# EAGLE design controller (EAGLE 4.11)
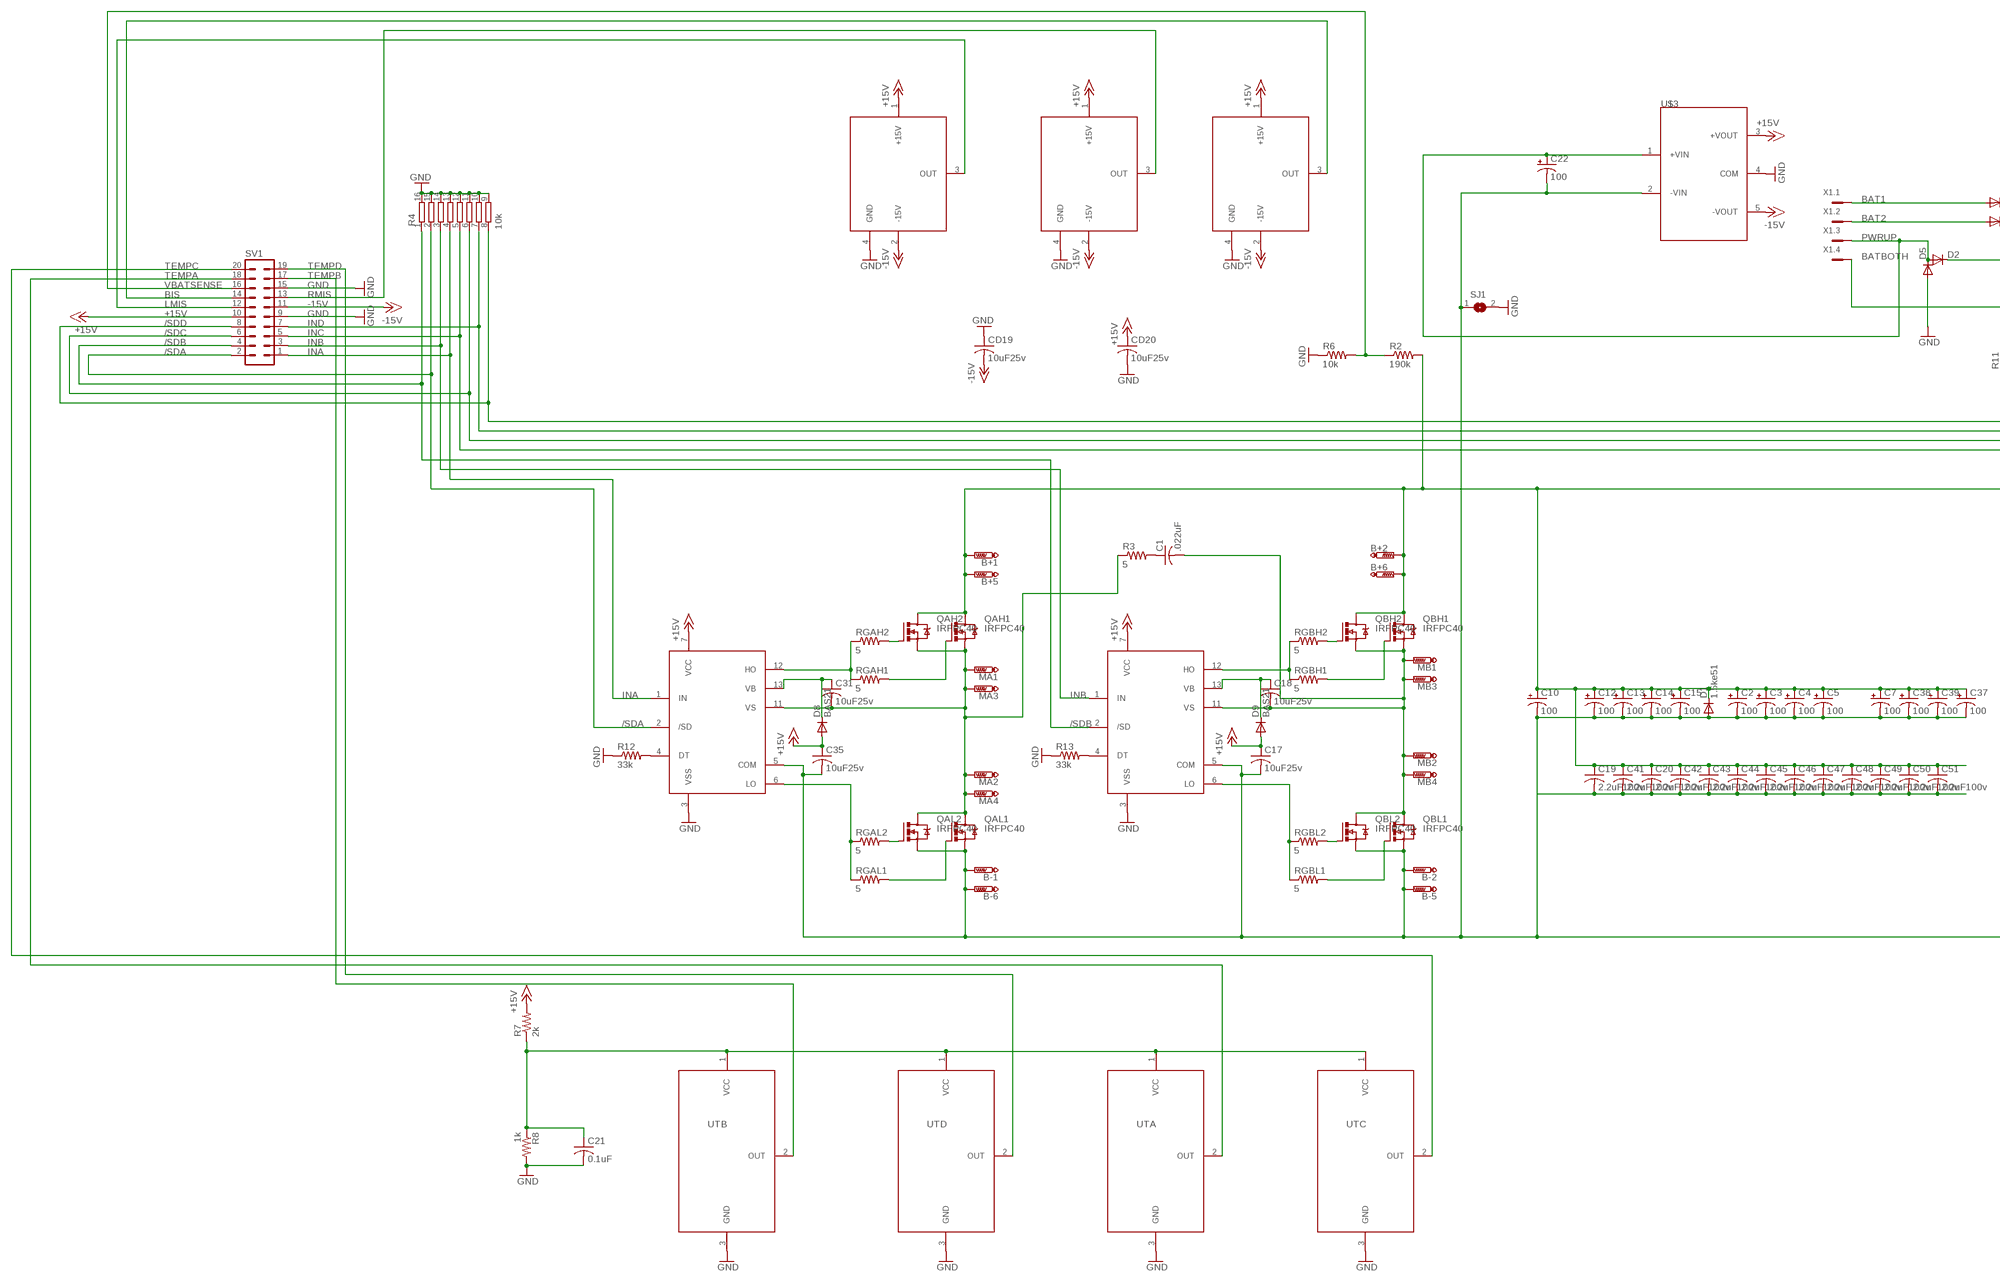
[diagram p0: schematic, sheet 1, part 1 of 2]
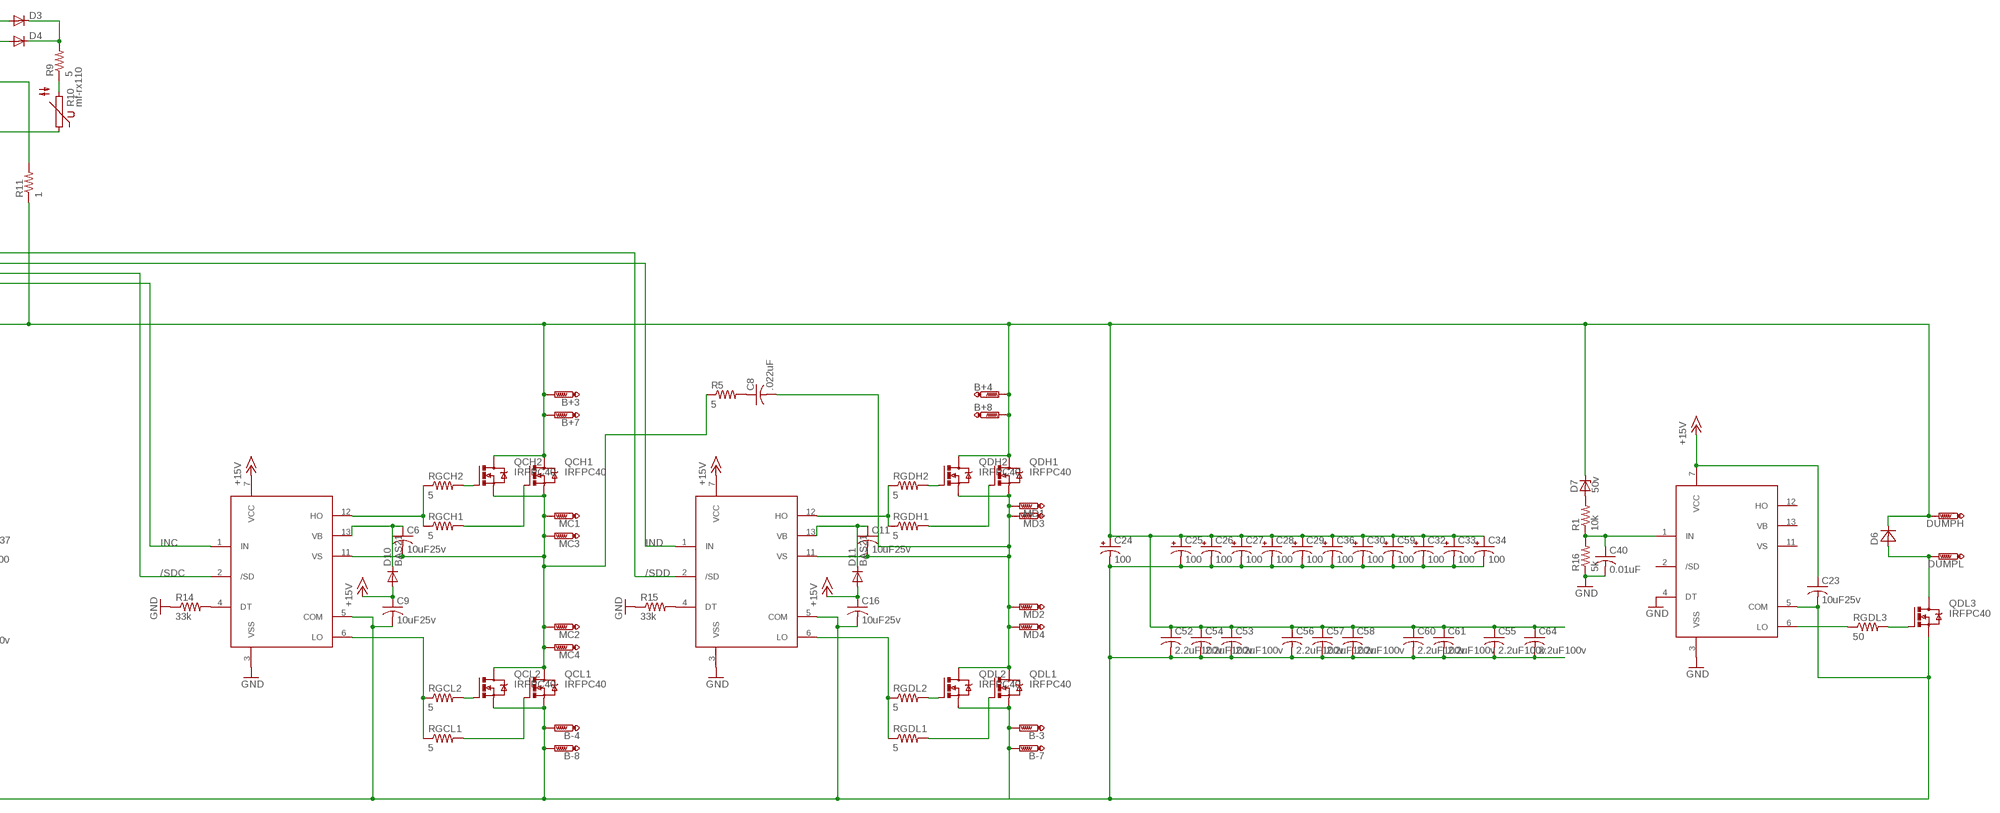
[diagram p1: schematic, sheet 1, part 2 of 2]

## Parts
B+1  PTR1PAD1-17Y  [P1-17Y]
B+2  PTR1PAD1-17Y  [P1-17Y]
B+3  PTR1PAD1-17Y  [P1-17Y]
B+4  PTR1PAD1-17Y  [P1-17Y]
B+5  PTR1PAD1-17Y  [P1-17Y]
B+6  PTR1PAD1-17Y  [P1-17Y]
B+7  PTR1PAD1-17Y  [P1-17Y]
B+8  PTR1PAD1-17Y  [P1-17Y]
B-1  PTR1PAD1-17Y  [P1-17Y]
B-2  PTR1PAD1-17Y  [P1-17Y]
B-3  PTR1PAD1-17Y  [P1-17Y]
B-4  PTR1PAD1-17Y  [P1-17Y]
B-5  PTR1PAD1-17Y  [P1-17Y]
B-6  PTR1PAD1-17Y  [P1-17Y]
B-7  PTR1PAD1-17Y  [P1-17Y]
B-8  PTR1PAD1-17Y  [P1-17Y]
C1  .022uF  C-US102-043X133  [C102-043X133]
C2  100  CPOL-USE5-10.5  [E5-10,5]
C3  100  CPOL-USE5-10.5  [E5-10,5]
C4  100  CPOL-USE5-10.5  [E5-10,5]
C5  100  CPOL-USE5-10.5  [E5-10,5]
C6  10uF25v  C-USC1206  [C1206]
C7  100  CPOL-USE5-10.5  [E5-10,5]
C8  .022uF  C-US102-043X133  [C102-043X133]
C9  10uF25v  C-USC1206  [C1206]
C10  100  CPOL-USE5-10.5  [E5-10,5]
C11  10uF25v  C-USC1206  [C1206]
C12  100  CPOL-USE5-10.5  [E5-10,5]
C13  100  CPOL-USE5-10.5  [E5-10,5]
C14  100  CPOL-USE5-10.5  [E5-10,5]
C15  100  CPOL-USE5-10.5  [E5-10,5]
C16  10uF25v  C-USC1206  [C1206]
C17  10uF25v  C-USC1206  [C1206]
C18  10uF25v  C-USC1206  [C1206]
C19  2.2uF100v  C-USC1812  [C1812]
C20  2.2uF100v  C-USC1812  [C1812]
C21  0.1uF  C-USC0805  [C0805]
C22  100  CPOL-USE5-10.5  [E5-10,5]
C23  10uF25v  C-USC1206  [C1206]
C24  100  CPOL-USE5-10.5  [E5-10,5]
C25  100  CPOL-USE5-10.5  [E5-10,5]
C26  100  CPOL-USE5-10.5  [E5-10,5]
C27  100  CPOL-USE5-10.5  [E5-10,5]
C28  100  CPOL-USE5-10.5  [E5-10,5]
C29  100  CPOL-USE5-10.5  [E5-10,5]
C30  100  CPOL-USE5-10.5  [E5-10,5]
C31  10uF25v  C-USC1206  [C1206]
C32  100  CPOL-USE5-10.5  [E5-10,5]
C33  100  CPOL-USE5-10.5  [E5-10,5]
C34  100  CPOL-USE5-10.5  [E5-10,5]
C35  10uF25v  C-USC1206  [C1206]
C36  100  CPOL-USE5-10.5  [E5-10,5]
C37  100  CPOL-USE5-10.5  [E5-10,5]
C38  100  CPOL-USE5-10.5  [E5-10,5]
C39  100  CPOL-USE5-10.5  [E5-10,5]
C40  0.01uF  C-USC0805  [C0805]
C41  2.2uF100v  C-USC1812  [C1812]
C42  2.2uF100v  C-USC1812  [C1812]
C43  2.2uF100v  C-USC1812  [C1812]
C44  2.2uF100v  C-USC1812  [C1812]
C45  2.2uF100v  C-USC1812  [C1812]
C46  2.2uF100v  C-USC1812  [C1812]
C47  2.2uF100v  C-USC1812  [C1812]
C48  2.2uF100v  C-USC1812  [C1812]
C49  2.2uF100v  C-USC1812  [C1812]
C50  2.2uF100v  C-USC1812  [C1812]
C51  2.2uF100v  C-USC1812  [C1812]
C52  2.2uF100v  C-USC1812  [C1812]
C53  2.2uF100v  C-USC1812  [C1812]
C54  2.2uF100v  C-USC1812  [C1812]
C55  2.2uF100v  C-USC1812  [C1812]
C56  2.2uF100v  C-USC1812  [C1812]
C57  2.2uF100v  C-USC1812  [C1812]
C58  2.2uF100v  C-USC1812  [C1812]
C59  100  CPOL-USE5-10.5  [E5-10,5]
C60  2.2uF100v  C-USC1812  [C1812]
C61  2.2uF100v  C-USC1812  [C1812]
C64  2.2uF100v  C-USC1812  [C1812]
CD19  10uF25v  C-USC1206  [C1206]
CD20  10uF25v  C-USC1206  [C1206]
D1  1.5ke51  DIODE-DO201-15  [DO201-15]
D2  DIODE-DO41-10  [DO41-10]
D3  DIODE-DO41-10  [DO41-10]
D4  DIODE-DO41-10  [DO41-10]
D5  DIODE-DO41-10  [DO41-10]
D6  DIODE-10  [D-10]
D7  50v  ZENER-DIODEZD-10  [ZDIO-10]
D8  BAS21  [SOT23]
D9  BAS21  [SOT23]
D10  BAS21  [SOT23]
D11  BAS21  [SOT23]
DRV1  IR21844S  [14-SOIC]
DRV2  IR21844S  [14-SOIC]
DRV3  IR21844S  [14-SOIC]
DRV4  IR21844S  [14-SOIC]
DUMPH  PTR1PAD1-17Y  [P1-17Y]
DUMPL  PTR1PAD1-17Y  [P1-17Y]
MA1  PTR1PAD1-17Y  [P1-17Y]
MA2  PTR1PAD1-17Y  [P1-17Y]
MA3  PTR1PAD1-17Y  [P1-17Y]
MA4  PTR1PAD1-17Y  [P1-17Y]
MB1  PTR1PAD1-17Y  [P1-17Y]
MB2  PTR1PAD1-17Y  [P1-17Y]
MB3  PTR1PAD1-17Y  [P1-17Y]
MB4  PTR1PAD1-17Y  [P1-17Y]
MC1  PTR1PAD1-17Y  [P1-17Y]
MC2  PTR1PAD1-17Y  [P1-17Y]
MC3  PTR1PAD1-17Y  [P1-17Y]
MC4  PTR1PAD1-17Y  [P1-17Y]
MD1  PTR1PAD1-17Y  [P1-17Y]
MD2  PTR1PAD1-17Y  [P1-17Y]
MD3  PTR1PAD1-17Y  [P1-17Y]
MD4  PTR1PAD1-17Y  [P1-17Y]
QAH1  IRFPC40  [TO247BV]
QAH2  IRFPC40  [TO247BV]
QAL1  IRFPC40  [TO247BV]
QAL2  IRFPC40  [TO247BV]
QBH1  IRFPC40  [TO247BV]
QBH2  IRFPC40  [TO247BV]
QBL1  IRFPC40  [TO247BV]
QBL2  IRFPC40  [TO247BV]
QCH1  IRFPC40  [TO247BV]
QCH2  IRFPC40  [TO247BV]
QCL1  IRFPC40  [TO247BV]
QCL2  IRFPC40  [TO247BV]
QDH1  IRFPC40  [TO247BV]
QDH2  IRFPC40  [TO247BV]
QDL1  IRFPC40  [TO247BV]
QDL2  IRFPC40  [TO247BV]
QDL3  IRFPC40  [TO247BV]
R1  10k  R-US_R0805  [R0805]
R2  190k  R-US_R0805  [R0805]
R3  5  R-US_0414/15  [0414/15]
R4  10k  4816P-T01  [4816P]
R5  5  R-US_0414/15  [0414/15]
R6  10k  R-US_R0805  [R0805]
R7  2k  R-US_R0805  [R0805]
R8  1k  R-US_R0805  [R0805]
R9  5  R-US_0414/15  [0414/15]
R10  mf-rx110  S05K40  [S05K40]
R11  1  R-US_0414/15  [0414/15]
R12  33k  R-US_R0805  [R0805]
R13  33k  R-US_R0805  [R0805]
R14  33k  R-US_R0805  [R0805]
R15  33k  R-US_R0805  [R0805]
R16  5k  R-US_R0805  [R0805]
RGAH1  5  R-US_R0805  [R0805]
RGAH2  5  R-US_R0805  [R0805]
RGAL1  5  R-US_R0805  [R0805]
RGAL2  5  R-US_R0805  [R0805]
RGBH1  5  R-US_R0805  [R0805]
RGBH2  5  R-US_R0805  [R0805]
RGBL1  5  R-US_R0805  [R0805]
RGBL2  5  R-US_R0805  [R0805]
RGCH1  5  R-US_R0805  [R0805]
RGCH2  5  R-US_R0805  [R0805]
RGCL1  5  R-US_R0805  [R0805]
RGCL2  5  R-US_R0805  [R0805]
RGDH1  5  R-US_R0805  [R0805]
RGDH2  5  R-US_R0805  [R0805]
RGDL1  5  R-US_R0805  [R0805]
RGDL2  5  R-US_R0805  [R0805]
RGDL3  50  R-US_R0805  [R0805]
SJ1  SJ  [SJ]
SV1  MA10-2  [MA10-2]
U$1  L08P150D15  [L08P]
U$2  L08P150D15  [L08P]
U$3  DFC10U48D15  [DFC10]
U$4  IR21844S  [14-SOIC]
U$5  L08P150D15  [L08P]
UTA  LM61BIM  [SOT23]
UTB  LM61BIM  [SOT23]
UTC  LM61BIM  [SOT23]
UTD  LM61BIM  [SOT23]
X1  MC4  [MC4]

## Nets
+15V [pwr]: C9.1 C16.1 C17.1 C23.1 C35.1 CD20.1 D8.1(A) D9.1(A) D10.1(A) D11.1(A) DRV1.7(VCC) DRV2.7(VCC) DRV3.7(VCC) DRV4.7(VCC) R7.2 SV1.10 U$1.1(+15V) U$2.1(+15V) U$3.3(+VOUT) U$4.7(VCC) U$5.1(+15V)
-15V [pwr]: CD19.2 SV1.11 U$1.2(-15V) U$2.2(-15V) U$3.5(-VOUT) U$5.2(-15V)
/SDA: DRV1.2(/SD) R4.2 SV1.2
/SDB: DRV2.2(/SD) R4.1 SV1.4
/SDC: DRV3.2(/SD) R4.6 SV1.6
/SDD: DRV4.2(/SD) R4.8 SV1.8
B+ [highpwr]: B+1.1(TP) B+2.1(TP) B+3.1(TP) B+4.1(TP) B+5.1(TP) B+6.1(TP) B+7.1(TP) B+8.1(TP) C2.+ C3.+ C4.+ C5.+ C7.+ C10.+ C12.+ C13.+ C14.+ C15.+ C19.1 C20.1 C24.+ C25.+ C26.+ C27.+ C28.+ C29.+ C30.+ C32.+ C33.+ C34.+ C36.+ C37.+ C38.+ C39.+ C41.1 C42.1 C43.1 C44.1 C45.1 C46.1 C47.1 C48.1 C49.1 C50.1 C51.1 C52.1 C53.1 C54.1 C55.1 C56.1 C57.1 C58.1 C59.+ C60.1 C61.1 C64.1 D1.C D6.2(K) D7.C DUMPH.1(TP) QAH1.D QAH2.D QBH1.D QBH2.D QCH1.D QCH2.D QDH1.D QDH2.D R2.2 R11.1
B- [highpwr]: B-1.1(TP) B-2.1(TP) B-3.1(TP) B-4.1(TP) B-5.1(TP) B-6.1(TP) B-7.1(TP) B-8.1(TP) C2.- C3.- C4.- C5.- C7.- C9.2 C10.- C12.- C13.- C14.- C15.- C16.2 C17.2 C19.2 C20.2 C22.- C23.2 C24.- C25.- C26.- C27.- C28.- C29.- C30.- C32.- C33.- C34.- C35.2 C36.- C37.- C38.- C39.- C41.2 C42.2 C43.2 C44.2 C45.2 C46.2 C47.2 C48.2 C49.2 C50.2 C51.2 C52.2 C53.2 C54.2 C55.2 C56.2 C57.2 C58.2 C59.- C60.2 C61.2 C64.2 D1.A DRV1.5(COM) DRV2.5(COM) DRV3.5(COM) DRV4.5(COM) QAL1.S QAL2.S QBL1.S QBL2.S QCL1.S QCL2.S QDL1.S QDL2.S QDL3.S SJ1.1 U$3.2(-VIN) U$4.5(COM)
BAT1 [highsig]: D3.A X1.1
BAT2 [highsig]: D4.A X1.2
BATBOTH: R10.1 X1.4
BIS: SV1.14 U$5.3(OUT)
GAH [highsig]: DRV1.12(HO) RGAH1.1 RGAH2.1
GAH1 [highsig]: DRV3.12(HO) RGCH1.1 RGCH2.1
GAL [highsig]: DRV1.6(LO) RGAL1.1 RGAL2.1
GAL1 [highsig]: DRV3.6(LO) RGCL1.1 RGCL2.1
GBH [highsig]: DRV2.12(HO) RGBH1.1 RGBH2.1
GBH1 [highsig]: DRV4.12(HO) RGDH1.1 RGDH2.1
GBL [highsig]: DRV2.6(LO) RGBL1.1 RGBL2.1
GBL1 [highsig]: DRV4.6(LO) RGDL1.1 RGDL2.1
GND [pwr]: C21.2 C40.2 CD19.1 CD20.2 D5.A DRV1.3(VSS) DRV2.3(VSS) DRV3.3(VSS) DRV4.3(VSS) R4.9 R4.10 R4.11 R4.12 R4.13 R4.14 R4.15 R4.16 R6.1 R8.2 R12.1 R13.1 R14.1 R15.1 R16.1 SJ1.2 SV1.9 SV1.15 U$1.4(GND) U$2.4(GND) U$3.4(COM) U$4.3(VSS) U$4.4(DT) U$5.4(GND) UTA.3(GND) UTB.3(GND) UTC.3(GND) UTD.3(GND)
INA: DRV1.1(IN) R4.4 SV1.1
INB: DRV2.1(IN) R4.3 SV1.3
INC: DRV3.1(IN) R4.5 SV1.5
IND: DRV4.1(IN) R4.7 SV1.7
LM61PWR: C21.1 R7.1 R8.1 UTA.1(VCC) UTB.1(VCC) UTC.1(VCC) UTD.1(VCC)
LMIS: SV1.12 U$1.3(OUT)
MA1 [highpwr]: C6.2 DRV3.11(VS) MC1.1(TP) MC2.1(TP) MC3.1(TP) MC4.1(TP) QCH1.S QCH2.S QCL1.D QCL2.D R5.1
MA2 [highpwr]: C31.2 DRV1.11(VS) MA1.1(TP) MA2.1(TP) MA3.1(TP) MA4.1(TP) QAH1.S QAH2.S QAL1.D QAL2.D R3.1
MB1 [highpwr]: C8.2 C11.2 DRV4.11(VS) MD1.1(TP) MD2.1(TP) MD3.1(TP) MD4.1(TP) QDH1.S QDH2.S QDL1.D QDL2.D
MB2 [highpwr]: C1.2 C18.2 DRV2.11(VS) MB1.1(TP) MB2.1(TP) MB3.1(TP) MB4.1(TP) QBH1.S QBH2.S QBL1.D QBL2.D
N$1 [highpwr]: D2.C R11.2
N$2 [highpwr]: C1.1 R3.2
N$3: DRV1.4(DT) R12.2
N$4: C8.1 R5.2
N$5: DRV3.4(DT) R14.2
N$6: DRV4.4(DT) R15.2
N$7 [highsig]: R9.1 R10.2
N$8 [highsig]: D3.C D4.C R9.2
N$9: DRV2.4(DT) R13.2
N$11: QDL3.G RGDL3.2
N$12: RGDL3.1 U$4.6(LO)
N$13: D7.A R1.2
N$14: D6.1(A) DUMPL.1(TP) QDL3.D
N$15: C40.1 R1.1 R16.2 U$4.1(IN)
PWRUP: C22.+ D2.A D5.C U$3.1(+VIN) X1.3
Q1G [highsig]: QAH1.G RGAH1.2
Q1G1 [highsig]: QCH1.G RGCH1.2
Q2G [highsig]: QAH2.G RGAH2.2
Q2G1 [highsig]: QCH2.G RGCH2.2
Q3G [highsig]: QAL1.G RGAL1.2
Q3G1 [highsig]: QCL1.G RGCL1.2
Q4G [highsig]: QAL2.G RGAL2.2
Q4G1 [highsig]: QCL2.G RGCL2.2
Q5G [highsig]: QBH1.G RGBH1.2
Q5G1 [highsig]: QDH1.G RGDH1.2
Q6G [highsig]: QBH2.G RGBH2.2
Q6G1 [highsig]: QDH2.G RGDH2.2
Q7G [highsig]: QBL1.G RGBL1.2
Q7G1 [highsig]: QDL1.G RGDL1.2
Q8G [highsig]: QBL2.G RGBL2.2
Q8G1 [highsig]: QDL2.G RGDL2.2
RMIS: SV1.13 U$2.3(OUT)
TEMPA: SV1.18 UTA.2(OUT)
TEMPB: SV1.17 UTB.2(OUT)
TEMPC: SV1.20 UTC.2(OUT)
TEMPD: SV1.19 UTD.2(OUT)
VB1 [pwr]: C31.1 D8.3(C) DRV1.13(VB)
VB2 [pwr]: C18.1 D9.3(C) DRV2.13(VB)
VB3 [pwr]: C6.1 D10.3(C) DRV3.13(VB)
VB4 [pwr]: C11.1 D11.3(C) DRV4.13(VB)
VBATSENSE: R2.1 R6.2 SV1.16
Unconnected: U$4.2(/SD) U$4.11(VS) U$4.12(HO) U$4.13(VB)

## Library data of the parts
B+1-B+8 B-1-B-8 DUMPH DUMPL MA1-MA4 MB1-MB4 MC1-MC4 MD1-MD4 = testpad:PTR1: TEST PIN
C1 C6 C8 C9 C11 C16-C21 C23 C31 C35 C40-C58 C60 C61 C64 CD19 CD20 = rcl:C-US: CAPACITOR, American symbol
C2-C5 C7 C10 C12-C15 C22 C24-C30 C32-C34 C36-C39 C59 = rcl:CPOL-US: POLARIZED CAPACITOR, American symbol
D1-D5 = diode:DIODE-: DIODE
D6 = discrete:DIODE-10
D7 = diode:ZENER-DIODE: Z-Diode
D8-D11 = tlb:BAS21: DIODE high speed (Philips)
DRV1-DRV4 U$4 = tlb:IR21844S
QAH1 QAH2 QAL1 QAL2 QBH1 QBH2 QBL1 QBL2 QCH1 QCH2 QCL1 QCL2 QDH1 QDH2 QDL1-QDL3 = transistor-power:IRFPC40: N-CHANNEL MOS FET
R1-R3 R5-R9 R11-R16 RGAH1 RGAH2 RGAL1 RGAL2 RGBH1 RGBH2 RGBL1 RGBL2 RGCH1 RGCH2 RGCL1 RGCL2 RGDH1 RGDH2 RGDL1-RGDL3 = rcl:R-US_: RESISTOR, American symbol
R4 = resistor-bourns:4816P-T01: BOURNS RESISTOR NETWORK
R10 = varistor:S05K40: VARISTOR
SJ1 = jumper:SJ: SMD solder JUMPER
SV1 = con-lstb:MA10-2: PIN HEADER
U$1 U$2 U$5 = tlb:L08P150D15
U$3 = tlb:DFC10U48D15
UTA UTB UTC UTD = tlb:LM61BIM
X1 = con-phoenix-381_l:MC4: Mini-Combicon 3.81mm horizontal 4-polig (ohne Gegenstecker)

## Net classes
0 default: width 0.203 mm
1 highpwr: width 0.61 mm, clearance 0.813 mm
2 highsig: width 0.406 mm, clearance 0.61 mm
3 pwr: width 0.254 mm, clearance 0.61 mm

## Board
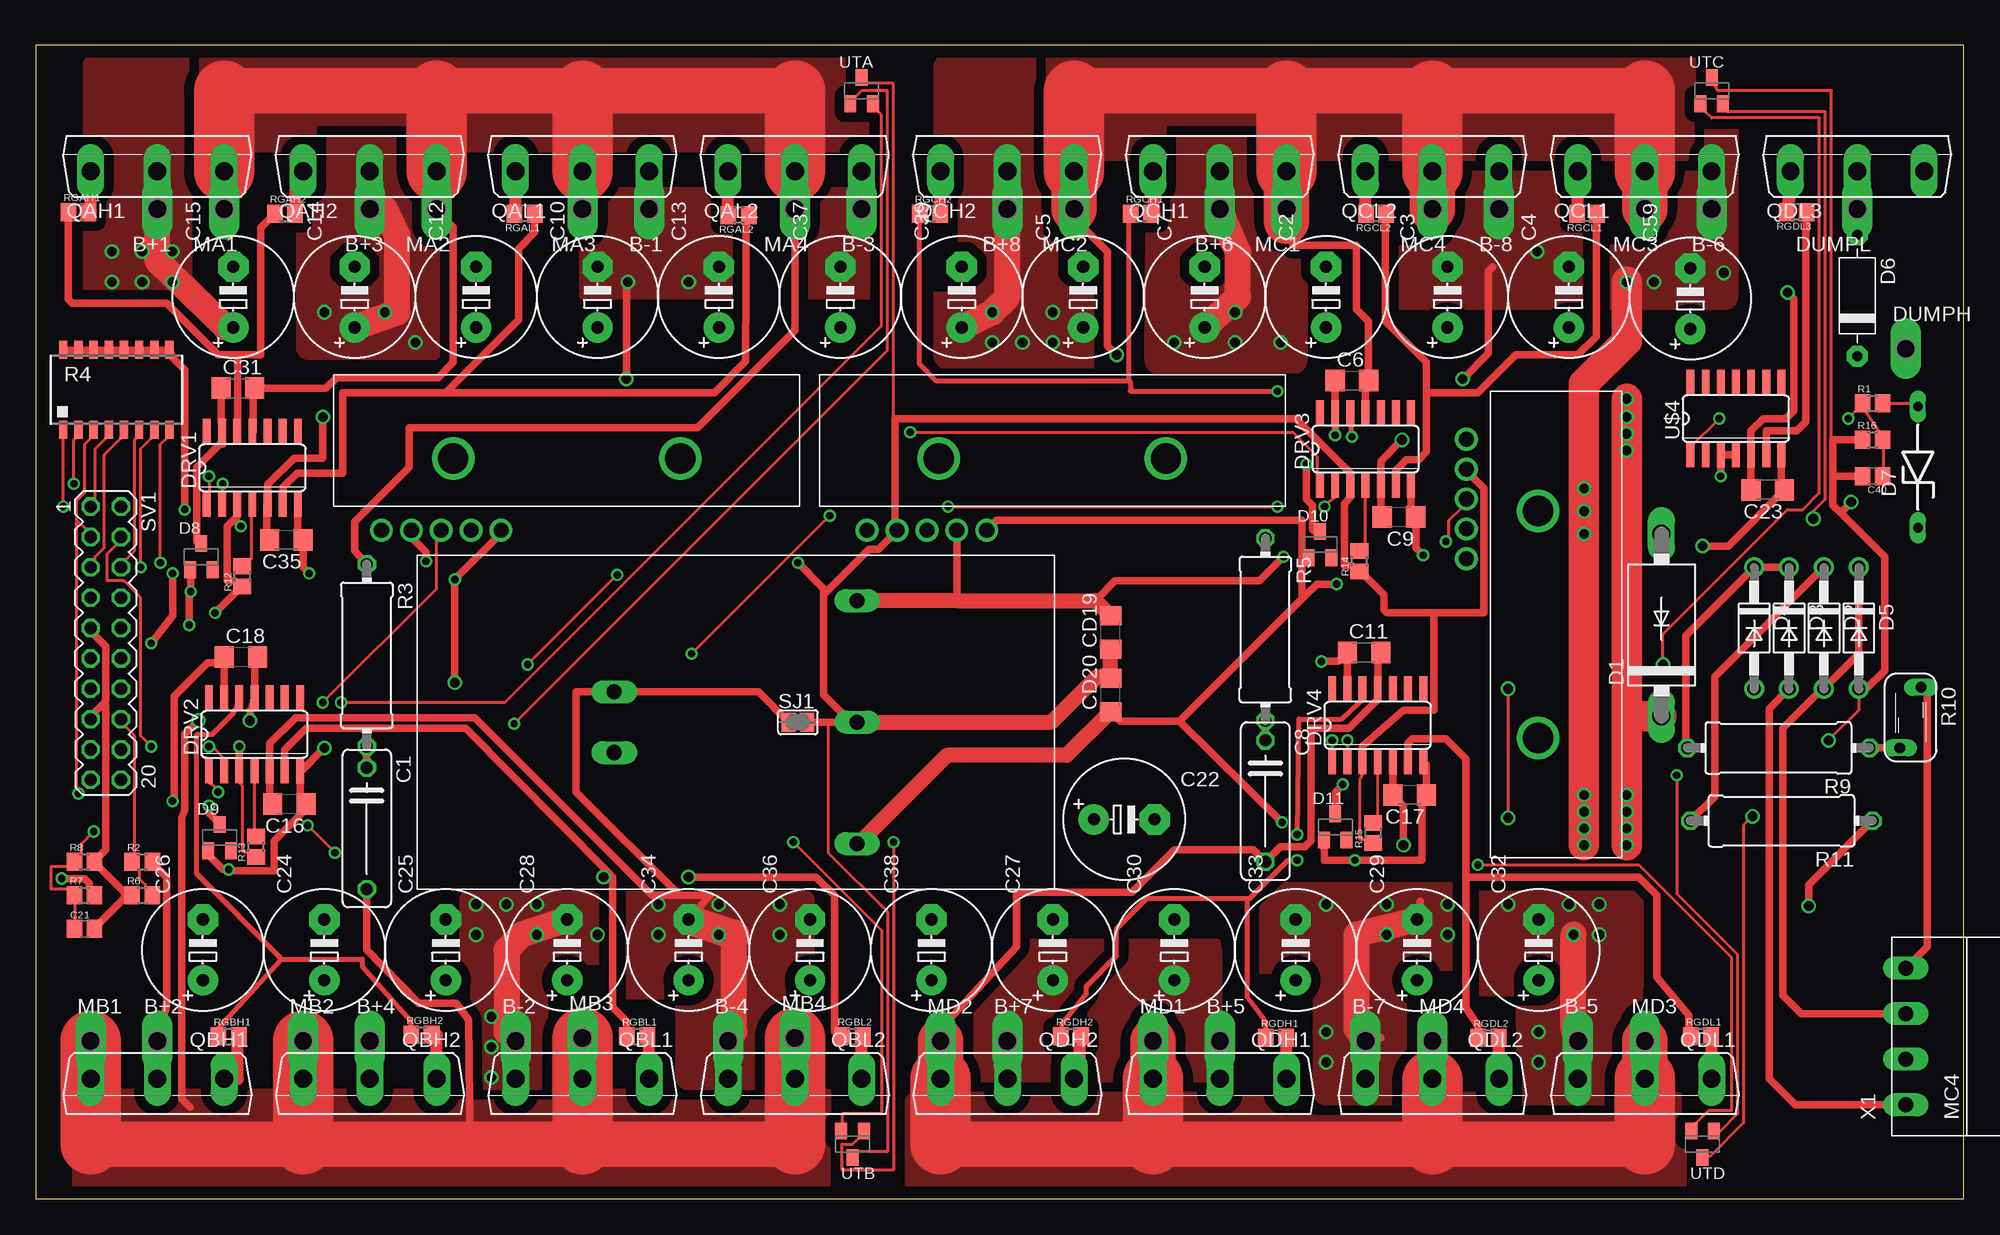
[diagram p2: board, top side]
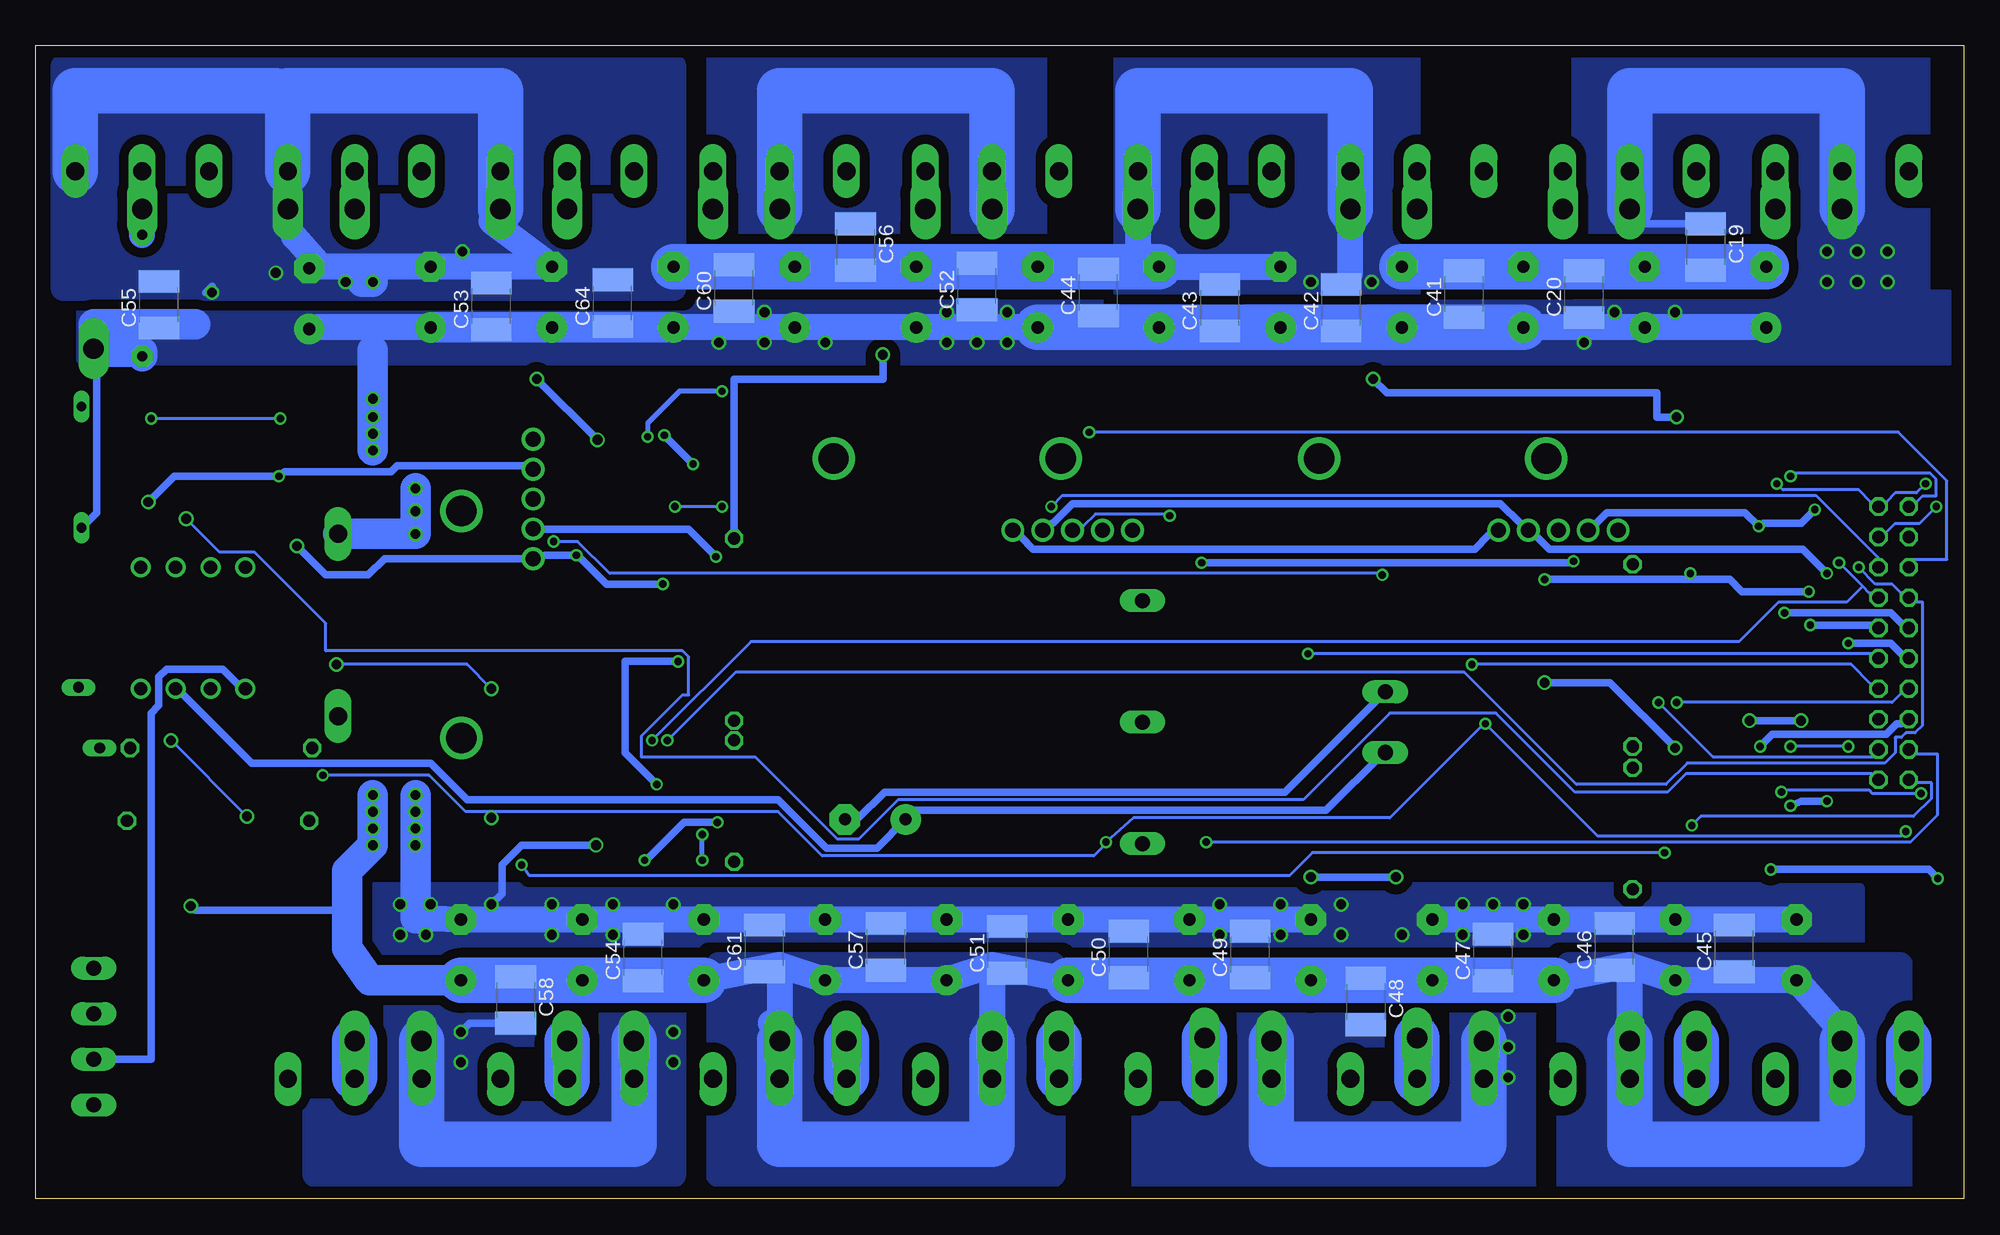
[diagram p3: board, bottom side, seen from below]

Size 161.29 x 96.52 mm. Coordinates in mm from the lower left corner, seen from the top.
Outline: 0,0 161.29,0 161.29,96.52 0,96.52 0,0
Copper layers (1*16): Top 0.035mm / dielectric 1.5mm / Bottom 0.035mm
Design rules "default": minimum track width 10mil, minimum drill 24mil, track to track 8mil, track to pad 8mil, pad to pad 8mil, via to via 8mil, smd to smd 8mil, copper to edge 40mil, drill to drill 8mil, minimum pad ring 10mil, minimum via ring 8mil, stop-mask expansion 4mil, vias tented up to drill 0mil, thermal gap 10mil

### Footprints (pad centres in the part's own frame; a part is rotated, then mirrored left to right if it is on the bottom)
P1-17Y = drill 1.702 pad 2.121 long: 1 0,0
C102-043X133 = drill 1.016 octagon: 1 -5.08,0; 2 5.08,0
E5-10,5 = drill 1.016 pad 2.54 round: + -2.54,0 | drill 1.016 pad 2.54 octagon: - 2.54,0
C1206 = smd 1.6 x 1.8: 1 -1.4,0; 2 1.4,0
C1812 = smd 1.9 x 3.4: 1 -1.95,0; 2 1.95,0
C0805 = smd 1.3 x 1.5: 1 -0.85,0; 2 0.85,0
DO201-15 = drill 1.499 long: A 7.62,0; C -7.62,0
DO41-10 = drill 1.118 round: A 5.08,0; C -5.08,0
D-10 = drill 0.813 pad 1.778 octagon: 1 -5.08,0; 2 5.08,0
ZDIO-10 = drill 0.813 long: A 5.08,0; C -5.08,0
SOT23 = smd 1 x 1.4: 1 -0.95,-1.1; 2 0.95,-1.1; 3 0,1.1
14-SOIC = smd 0.66 x 2.032: 1 -3.81,-3.073; 2 -2.54,-3.073; 3 -1.27,-3.073; 4 0,-3.073; 5 1.27,-3.073; 6 2.54,-3.073; 7 3.81,-3.073; 8 3.81,3.073; 9 2.54,3.073; 10 1.27,3.073; 11 0,3.073; 12 -1.27,3.073; 13 -2.54,3.073; 14 -3.81,3.073
TO247BV = drill 1.499 long: D 0,-2.921; G -5.588,-2.921; S 5.588,-2.921
R0805 = smd 1.3 x 1.5: 1 -0.85,0; 2 0.85,0
0414/15 = drill 1.016 octagon: 1 -7.62,0; 2 7.62,0
4816P = smd 0.7 x 1.5: 1 -4.445,-3.346; 2 -3.175,-3.346; 3 -1.905,-3.346; 4 -0.635,-3.346; 5 0.635,-3.346; 6 1.905,-3.346; 7 3.175,-3.346; 8 4.445,-3.346; 9 4.445,3.346; 10 3.175,3.346; 11 1.905,3.346; 12 0.635,3.346; 13 -0.635,3.346; 14 -1.905,3.346; 15 -3.175,3.346; 16 -4.445,3.346
S05K40 = drill 0.914 long: 1 -0.889,-2.54; 2 0.889,2.54
SJ = smd 1.168 x 1.6: 1 -0.762,0; 2 0.762,0
MA10-2 = drill 1.016 octagon: 1 -11.43,-1.27; 2 -11.43,1.27; 3 -8.89,-1.27; 4 -8.89,1.27; 5 -6.35,-1.27; 6 -6.35,1.27; 7 -3.81,-1.27; 8 -3.81,1.27; 9 -1.27,-1.27; 10 -1.27,1.27; 11 1.27,-1.27; 12 1.27,1.27; 13 3.81,-1.27; 14 3.81,1.27; 15 6.35,-1.27; 16 6.35,1.27; 17 8.89,-1.27; 18 8.89,1.27; 19 11.43,-1.27; 20 11.43,1.27
L08P = drill 1.27 round: 1 -3,-3; 2 -5.5,-3; 3 -8,-3; 4 -10.5,-3; 5 -13,-3 | drill 2.54 round: P$6 -7,3; P$7 12,3
DFC10 = drill 1.27 long: 1 0,-2.54; 2 0,2.54; 3 20.32,-10.16; 4 20.32,0; 5 20.32,10.16
MC4 = drill 1.27 long: 1 -5.715,0; 2 -1.905,0; 3 1.905,0; 4 5.715,0

### Placement (x,y rotation side)
B+1  10.16,82.8 180 top
B+2  10.16,13.21 0 top
B+3  27.94,82.8 180 top
B+4  27.94,13.21 0 top
B+5  99.06,13.21 0 top
B+6  99.06,82.8 180 top
B+7  81.28,13.21 0 top
B+8  81.28,82.8 180 top
B-1  51.31,82.8 180 top
B-2  40.13,13.21 0 top
B-3  69.09,82.8 180 top
B-4  57.91,13.21 0 top
B-5  129.03,13.21 0 top
B-6  140.21,82.8 180 top
B-7  111.25,13.21 0 top
B-8  122.43,82.8 180 top
C1  27.69,30.99 270 top
C2  107.95,75.44 90 top
C3  118.11,75.44 90 top
C4  128.27,75.44 90 top
C5  87.63,75.44 90 top
C6  110.11,68.45 0 top
C7  97.79,75.44 90 top
C8  102.87,33.27 270 top
C9  114.05,57.02 180 top
C10  46.99,75.44 90 top
C11  111.12,45.72 0 top
C12  36.83,75.44 90 top
C13  57.15,75.44 90 top
C14  26.67,75.44 90 top
C15  16.51,75.44 90 top
C16  21.21,33.02 180 top
C17  114.94,33.78 180 top
C18  17.14,45.34 0 top
C19  21.59,79.63 270 bottom
C20  31.75,75.69 90 bottom
C21  4.06,22.61 0 top
C22  91.06,31.75 0 top
C23  144.91,59.31 180 top
C24  24.13,20.83 90 top
C25  34.29,20.83 90 top
C26  13.97,20.83 90 top
C27  85.09,20.83 90 top
C28  44.45,20.83 90 top
C29  115.57,20.83 90 top
C30  95.25,20.83 90 top
C31  16.89,67.82 0 top
C32  125.73,20.83 90 top
C33  105.41,20.83 90 top
C34  54.61,20.83 90 top
C35  20.95,55.12 180 top
C36  64.77,20.83 90 top
C37  67.31,75.44 90 top
C38  74.93,20.83 90 top
C39  77.47,75.44 90 top
C40  153.67,60.45 180 top
C41  41.78,75.69 90 bottom
C42  52.07,74.55 90 bottom
C43  62.23,74.55 90 bottom
C44  72.39,75.82 90 bottom
C45  19.18,20.95 90 bottom
C46  29.21,21.08 90 bottom
C47  39.37,20.19 90 bottom
C48  50.04,16.51 270 bottom
C49  59.69,20.45 90 bottom
C50  69.85,20.45 90 bottom
C51  80.01,20.83 90 bottom
C52  82.55,76.33 90 bottom
C53  123.19,74.68 90 bottom
C54  110.49,20.19 90 bottom
C55  151,74.8 90 bottom
C56  92.71,79.63 270 bottom
C57  90.17,21.08 90 bottom
C58  121.16,16.64 270 bottom
C59  138.43,75.31 90 top
C60  102.87,76.2 90 bottom
C61  100.33,20.95 90 bottom
C64  113.03,74.93 90 bottom
CD19  89.92,47.37 90 top
CD20  89.92,42.16 90 top
D1  136.02,48.01 90 top
D2  149.61,47.75 270 top
D3  146.69,47.75 270 top
D4  143.76,47.75 270 top
D5  152.53,47.75 270 top
D6  152.4,75.56 270 top
D7  157.48,61.21 90 top
D8  13.84,53.72 0 top
D9  15.37,30.23 0 top
D10  107.44,54.74 0 top
D11  108.71,31.11 0 top
DRV1  18.11,61.16 0 top
DRV2  18.29,38.86 0 top
DRV3  111.25,62.74 0 top
DRV4  112.27,39.62 0 top
DUMPH  156.46,71.12 0 top
DUMPL  152.4,82.8 180 top
MA1  15.75,82.8 180 top
MA2  33.53,82.8 180 top
MA3  45.72,82.8 180 top
MA4  63.5,82.8 180 top
MB1  4.57,13.21 0 top
MB2  22.35,13.21 0 top
MB3  45.72,13.46 0 top
MB4  63.5,13.46 0 top
MC1  104.65,82.8 180 top
MC2  86.87,82.8 180 top
MC3  134.62,82.8 180 top
MC4  116.84,82.8 180 top
MD1  93.47,13.21 0 top
MD2  75.69,13.21 0 top
MD3  134.62,13.21 0 top
MD4  116.84,13.21 0 top
QAH1  10.16,88.9 0 top
QAH2  27.94,88.9 0 top
QAL1  45.72,88.9 0 top
QAL2  63.5,88.9 0 top
QBH1  10.16,7.11 180 top
QBH2  27.94,7.11 180 top
QBL1  45.72,7.11 180 top
QBL2  63.5,7.11 180 top
QCH1  99.06,88.9 0 top
QCH2  81.28,88.9 0 top
QCL1  134.62,88.9 0 top
QCL2  116.84,88.9 0 top
QDH1  99.06,7.11 180 top
QDH2  81.28,7.11 180 top
QDL1  134.62,7.11 180 top
QDL2  116.84,7.11 180 top
QDL3  152.4,88.9 0 top
R1  153.67,66.55 0 top
R2  8.89,28.19 0 top
R3  27.69,45.47 270 top
R4  6.73,67.69 0 top
R5  102.87,47.62 270 top
R6  8.89,25.4 0 top
R7  4.06,25.4 0 top
R8  4.06,28.19 0 top
R9  145.8,37.72 180 top
R10  156.84,40.26 180 top
R11  146.05,31.62 180 top
R12  17.27,52.07 90 top
R13  18.41,29.46 90 top
R14  110.74,53.34 90 top
R15  111.89,30.61 90 top
R16  153.67,63.5 0 top
RGAH1  3.56,82.55 0 top
RGAH2  20.83,82.42 0 top
RGAL1  40.89,82.42 180 top
RGAL2  58.8,82.3 180 top
RGBH1  16.13,13.59 0 top
RGBH2  32.26,13.72 0 top
RGBL1  50.29,13.59 0 top
RGBL2  68.33,13.59 0 top
RGCH1  92.46,82.42 0 top
RGCH2  74.8,82.42 0 top
RGCL1  129.79,82.42 180 top
RGCL2  112.14,82.42 180 top
RGDH1  103.76,13.46 0 top
RGDH2  86.61,13.59 0 top
RGDL1  139.32,13.59 0 top
RGDL2  121.54,13.46 0 top
RGDL3  147.32,82.55 180 top
SJ1  63.75,39.88 0 top
SV1  5.84,46.48 270 top
U$1  82.55,58.93 0 top
U$2  41.91,58.93 0 top
U$3  48.39,39.88 0 top
U$4  142.24,65.28 0 top
U$5  122.68,50.55 270 top
UTA  69.09,92.71 0 top
UTB  68.33,4.57 180 top
UTC  140.21,92.71 0 top
UTD  139.45,4.57 180 top
X1  156.46,13.59 90 top

### Tracks (layer width: path | path; a pad name or v marks a point on that pad's centre or on a via)
+15V  (via drill 0.61, 0.81)
  Top 0.61: v2.16,26.8 4.06,26.8 4.45,26.42 4.45,26.04 R7.2 | v12.83,48.01 12.83,50.42 v12.95,50.8 12.95,52.45 12.89,52.51 D8.1 | U$2.1 38.86,55.63 v35.05,51.82 v35.05,43.18 | 106.11,50.36 95.69,39.94 | 105.92,53.59 105.92,56.77 80.39,56.77 U$1.1 | 105.92,53.59 105.92,50.55 106.11,50.36 | 95.69,39.94 v104.27,31.5 | D9.1 14.42,28.89 14.35,28.83 15.62,27.56 v16.13,27.56 16.51,27.43 19.94,27.43 19.94,29.97 22.61,32.64 C16.1 22.1,33.53 DRV2.7 22.2,35.79 v24.13,37.72 | D11.1 107.8,28.32 v110.36,28.32 115.95,28.32 115.95,33.4 C17.1 116.33,36.3 DRV4.7 | D10.1 106.45,53.59 105.92,53.59 | 106.11,50.36 107.19,51.44 v108.84,51.44 | 22.86,52.45 v22.86,52.32 22.35,52.83 C35.1 | DRV3.7 115.06,57.15 115.45,57.15 C9.1 115.45,54.48 v116.08,53.85 | C35.1 | DRV1.7 21.92,55.55 C35.1 | U$4.7 146.05,59.94 146.3,59.69 C23.1 141.61,54.61 v139.45,54.61 | 95.69,39.94 90.74,39.94 CD20.1
  Top 1.27: 68.71,29.59 68.58,29.46 | 68.71,29.59 U$3.3 | 68.71,29.59 76.21,37.1 86.25,37.1 CD20.1
  Bottom 0.61: v2.16,26.8 2.92,27.56 v16.13,27.56 | v12.83,48.01 7.75,48.01 SV1.10 | v12.95,50.8 18.54,50.8 19.56,51.82 22.86,51.82 | v35.05,51.82 22.86,51.82 | v104.27,31.5 107.06,31.5 109.98,28.57 v110.36,28.32 | v108.84,51.44 113.54,51.44 115.7,53.59 v116.08,53.85 118.74,53.85 U$5.1 132.13,53.55 133.48,52.2 137.03,52.2 v139.45,54.61 | U$2.1 39.75,55.5 40.89,54.36 77.85,54.36 78.87,55.37 U$1.1 | 22.86,51.82 v22.86,52.32 | v24.13,37.72 29.59,43.18 v35.05,43.18
-15V  (via drill 0.61)
  Top 0.61: v9.65,46.48 11.43,48.77 v11.43,52.32 | U$1.2 77.09,54.99 77.09,50.04 | v104.39,53.72 102.36,51.69 90.3,51.69 88.65,50.04
  Top 1.27: U$3.5 77.09,50.04 88.65,50.04 CD19.2
  Bottom 0.61: v9.65,46.48 6.1,46.48 5.21,45.59 SV1.11 | v11.43,52.32 13.46,54.36 34.67,54.36 35.69,55.37 U$2.2 37.08,56.52 38.74,58.17 74.55,58.17 76.2,56.52 76.33,56.52 U$1.2 | v104.39,53.72 106.68,56.01 118.74,56.01 U$5.2
/SDA  (via drill 0.61)
  Top 0.254: v3.17,59.82 3.17,63.5 3.3,63.63 R4.2 | v15.62,59.82 15.62,59.05 DRV1.2
  Bottom 0.254: v3.17,59.82 3.94,59.05 5.71,59.05 6.48,58.29 SV1.2 7.75,58.29 8.76,59.31 15.11,59.31 v15.62,59.82
/SDB  (via drill 0.61)
  Top 0.254: v2.29,57.91 R4.1 | v14.48,37.85 14.73,37.85 15.75,36.83 DRV2.2 | v9.65,37.85 8.76,38.74 8.76,50.29 7.37,51.69 5.97,51.69 5.97,53.98 6.73,54.74 SV1.4
  Bottom 0.254: v2.29,57.91 3.68,56.52 5.71,56.52 6.48,55.75 SV1.4 | v9.65,37.85 v14.48,37.85
/SDC  (via drill 0.61)
  Top 0.254: R4.6 8.38,63.63 8.26,63.5 8.26,54.23 7.49,53.47 SV1.6 | v107.82,57.91 107.82,58.04 108.71,58.67 DRV3.2 | v76.33,57.91 v103.89,57.91
  Bottom 0.254: v103.89,57.91 v107.82,57.91 | v76.33,57.91 75.44,58.8 12.32,58.8 6.98,53.47 SV1.6
/SDD  (via drill 0.61)
  Top 0.254: v10.41,53.21 10.41,63.12 10.92,63.63 R4.8 | v109.73,38.35 DRV4.2
  Bottom 0.254: 8.45,51.24 7.87,50.67 7.75,50.67 SV1.8 | 8.45,51.24 v10.41,53.21 | v109.73,38.35 101.47,46.61 18.8,46.61 15.49,49.91 9.78,49.91 8.45,51.24
B+  (via drill 0.81)
  Top 0.61: R2.2 10.29,27.56 10.92,26.92 10.92,16.26 B+2.1 | v148.34,24.51 148.34,26.29 R11.1
  Top 2.184: B+6.1 100.58,79.25 100.58,75.44 C7.+ | B+8.1 81.28,75.44 v80.01,74.17 C39.+ | B+3.1 29.21,82.8 30.23,80.64 30.23,74.17 C14.+ | B+1.1 10.16,78.49 15.88,72.9 C15.+ | 133.1,40.39 132.97,40.39
  Top 2.54: v133.1,29.59 133.1,40.39 | 133.1,40.39 v133.1,66.93 | 133.1,40.39 D1.C
  Bottom 0.61: v148.34,24.51 147.96,24.13 135.26,24.13 | DUMPH.1 156.21,70.87 156.21,57.4 D7.C | C54.1 110.36,18.8 109.85,18.29 C33.+ | C58.1 120.78,18.92 121.41,18.29 C32.+ | C50.1 69.85,18.41 69.98,18.29 C38.+ | C49.1 59.69,18.54 59.94,18.29 C36.+ | C47.1 39.37,18.29 39.24,18.41 | C34.+ 54.57,18.24 50.46,18.24 50.17,18.54 50.08,18.46 C48.1 | C19.1 26.71,81.58 B+3.1 | C56.1 92.71,81.66
  Bottom 2.184: 99.82,14.73 B+5.1 99.06,19.56 | 27.94,19.56 C24.+ C26.+ 10.16,13.97 B+2.1 | 27.94,19.56 C25.+ | C38.+ 81.28,19.56 | 81.28,19.56 C27.+ C30.+ 99.06,19.56 | 99.06,19.56 C33.+ | 81.28,19.56 B+7.1 | C15.+ C14.+ C12.+ | C39.+ C5.+ C7.+ C2.+ | B+4.1 27.94,19.56 | C4.+ 132.46,72.9 | 132.46,72.9 137.92,72.9 | 128.14,72.9 132.46,72.9 | v133.1,64.01 v133.1,62.61 | v133.1,66.93 v133.1,65.41
  Bottom 2.54: C4.+ 128.14,72.9 C3.+ C2.+ | C32.+ 133.35,18.29 135.26,20.95 135.26,24.13 135.26,27.43 v133.1,29.59 v133.1,30.99 v133.1,32.38 v133.1,33.78 | 133.1,70.99 v133.1,66.93 v133.1,65.41 v133.1,64.01 v133.1,62.61 | C28.+ 39.37,18.29 | 147.96,73.15 156.46,73.15 DUMPH.1 | 156.21,70.87 152.4,70.87 D6.2
  Bottom 3.81: B+1.1 QAH1.D 10.16,92.71 27.94,92.71 QAH2.D B+3.1 | B+5.1 99.06,10.16 | B+7.1 QDH2.D 81.28,4.57 99.06,4.57 99.06,10.16 | B+2.1 QBH1.D 10.16,4.57 27.94,4.57 QBH2.D B+4.1 | B+6.1 QCH1.D 99.06,92.71 81.28,92.71 QCH2.D B+8.1 | 99.06,10.16 QDH1.D | C25.+ C28.+ C34.+ C36.+ C38.+ | C33.+ C29.+ C32.+ | C12.+ C10.+ C13.+ C37.+ C39.+
  other vias: 11.43,76.71 29.21,74.17 24.13,74.17 31.75,71.63 100.33,74.17 104.14,71.63 11.43,79.25 8.89,76.71 6.35,76.71 6.35,79.25 8.89,79.25 80.01,71.63 82.55,71.63 85.09,71.63 85.09,74.17 95.25,71.63 100.33,71.63
  pour Bottom (isolate 0.61, no thermals): 5.33,19.56 33.02,19.56 33.02,1.27 5.33,1.27
  pour Bottom (isolate 0.61, no thermals): 76.2,19.56 104.14,19.56 104.14,2.03 76.2,2.03
  pour Bottom (isolate 0.61, no thermals): 3.81,95.38 31.75,95.38 31.75,74.17 3.81,74.17
  pour Bottom (isolate 0.61, no thermals): 77.72,95.5 104.14,95.5 104.14,79.5 77.72,79.5
  pour Top (isolate 0.61, no thermals): 4.57,95 12.45,95 12.45,73.28 4.57,73.28
  pour Top (isolate 0.61, no thermals): 22.86,87.88 34.29,87.88 34.29,71.25 22.86,71.25
  pour Top (isolate 0.61, no thermals): 76.2,94.74 83.19,94.74 83.19,80.26 87.88,76.45 87.88,70.36 76.2,70.36
  pour Top (isolate 0.406, no thermals): 93.98,87.88 105.41,87.88 105.28,70.1 93.85,70.1
  pour Bottom (isolate 0.61, rank 2, no thermals): 1.27,75.44 157.35,75.44 157.35,70.36 1.27,70.36
  pour Top (isolate 0.61, rank 2, no thermals): 78.74,21.46 98.81,21.46 98.93,20.57 98.93,10.16 99.06,10.03 78.74,10.03
B-  (via drill 0.81)
  Top 0.61: B-7.1 112.52,13.46 | 53.85,25.4 56.39,25.4 C34.- | 53.85,25.4 51.56,25.4 36.7,40.26 21.72,40.26 19.56,38.1 DRV2.5 19.56,33.4 19.81,33.15 19.81,33.14 C16.2 | 48.26,42.42 45.21,42.42 45.21,34.04 53.85,25.4 | C29.- 115.82,24.89 | v146.56,75.82 147.07,75.31 147.07,65.91 146.43,65.28 144.53,65.28 143.51,64.26 U$4.5 143.51,59.82 143.51,59.81 C23.2 | 48.26,42.42 U$3.2 | SJ1.1 60.45,42.42 48.26,42.42 | v114.3,63.5 112.52,61.72 112.52,59.69 | v119.38,68.58 121.54,70.74 121.54,77.6 121.92,77.98 | 112.52,59.69 DRV3.5 | DRV4.5 113.54,34.42 C17.2 114.43,32.89 v114.43,29.59 | v24,65.41 24,61.98 21.59,61.98 19.38,59.77 DRV1.5 19.3,58.01 19.3,55.37 C35.2 | v49.4,68.58 49.4,76.58 v49.53,76.71 | C9.2 112.52,57.02 112.52,59.69
  Top 2.184: B-7.1 110.49,14.22 110.49,22.1 C29.- | B-5.1 128.65,14.22 v128.65,22.1 | B-4.1 58.42,13.97 58.42,22.1 | B-2.1 39.37,13.97 39.37,20.83 40.64,22.1 C28.- | 129.54,53.85 129.41,53.85 v129.54,55.63
  Top 2.54: 58.42,22.1 C34.- | v129.54,29.59 129.54,53.85 129.54,57.4 | v133.1,76.71 133.1,71.75 129.54,68.2 v129.54,57.53 129.54,57.4 | 129.54,57.4 v129.54,55.63
  Bottom 0.61: U$3.2 56.77,34.04 90.3,34.04 92.58,31.75 C22.- | v114.3,63.5 v119.38,68.58 | v24,65.41 25.65,65.41 25.65,67.44 48.26,67.44 v49.4,68.58 | v146.56,75.82 147.07,75.82 146.56,76.33 | C19.2 26.33,77.64 C14.- | C20.2 36.49,77.64 C12.- 41.28,77.98 41.66,77.6 41.7,77.64 C41.2 | C44.2 67.52,77.77 C37.- | C52.2 87.33,78.28 C5.- | C7.- 97.62,78.15 93.26,78.15 92.79,77.68 C56.2 | C60.2 107.78,78.15 C2.- | C58.2 125.01,14.69 v125.73,13.97 | v114.43,29.59 120.65,29.59 122.3,27.94 122.3,25.53 v123.19,24.64
  Bottom 2.184: C26.- C24.- C25.- C28.- | C34.- C36.- C38.- C27.- C30.- C33.- C29.- C32.- 129.54,23.5 | C13.- C37.- 69.09,77.47 B-3.1 | B-8.1 123.19,81.79 C3.- C4.- 137.41,77.98 139.7,80.52 | 51.31,77.47 B-1.1
  Bottom 2.54: 129.54,23.5 v129.54,29.59 v129.54,30.99 v129.54,32.38 v129.54,33.78 | v133.1,76.71 133.99,76.71 | D1.A v129.54,55.63 v129.54,57.53 v129.54,59.44
  Bottom 3.81: B-1.1 QAL1.S 51.31,92.71 69.09,92.71 QAL2.S B-3.1 | B-5.1 QDL1.S 129.03,4.57 111.25,4.57 QDL2.S B-7.1 | B-2.1 QBL1.S 40.13,4.57 57.91,4.57 QBL2.S B-4.1 | QCL1.S 140.21,92.71 122.43,92.71 QCL2.S B-8.1 | C15.- C14.- C12.- C10.- | C37.- C39.- C5.- C7.- C2.- | QDL3.S 157.99,92.71 141.22,92.71
  other vias: 36.83,22.1 41.91,22.1 46.99,22.1 36.83,24.64 39.37,24.64 41.91,24.64 52.07,24.64 57.15,22.1 57.15,24.64 62.23,24.64 62.23,22.1 52.07,22.1 113.03,22.1 118.11,22.1 113.03,24.64 107.95,24.64 128.27,24.64 130.81,24.64 130.81,22.1 107.95,13.97 107.95,11.43 125.73,11.43 38.1,15.24 38.1,12.7 38.1,10.16 125.6,79.25 135.38,76.71 141.22,77.47 54.61,76.71 118.11,24.64
  pour Bottom (isolate 0.61, no thermals): 36.83,19.56 68.58,19.56 68.58,1.27 36.83,1.27
  pour Top (isolate 0.61, no thermals): 54.61,24.38 63.5,24.38 63.5,10.16 54.61,10.16
  pour Top (isolate 0.61, no thermals): 36.83,24.38 45.72,24.38 45.72,10.16 36.83,10.16
  pour Bottom (isolate 0.61, no thermals): 107.95,19.56 137.92,19.56 137.92,2.03 107.95,2.03
  pour Top (isolate 0.61, no thermals): 107.95,24.38 115.57,24.38 115.57,8.89 107.95,8.89
  pour Top (isolate 0.61, no thermals): 124.46,24.64 133.35,24.64 133.35,8.89 124.46,8.89
  pour Bottom (isolate 0.61, no thermals): 107.95,94.74 159,94.74 159,76.2 107.95,76.2
  pour Bottom (isolate 0.61, no thermals): 46.48,95.25 70.1,95.38 70.1,75.44 46.48,75.18
  pour Bottom (isolate 0.61, rank 2, no thermals): 8.89,20.83 132.84,20.83 132.84,25.91 8.89,25.91
  pour Top (isolate 0.61, rank 2, no thermals): 102.87,25.91 133.86,25.91 133.86,17.53 102.87,17.53
  pour Top (isolate 0.61, rank 2, no thermals): 36.07,25.15 64.52,25.15 64.52,17.27 36.07,17.27
  pour Top (isolate 0.61, rank 2, no thermals): 45.72,84.33 70.99,84.33 70.99,75.56 45.72,75.56
  pour Top (isolate 0.61, rank 3, no thermals): 113.54,90.17 141.35,90.17 141.35,75.44 113.54,75.44
BAT1
  Top 0.61: X1.1 147.19,7.87 145.03,10.03 145.03,41.02 D3.A
BAT2
  Bottom 0.61: X1.2 151.64,11.68 151.64,40.64 151,41.28 151,43.69 150.37,44.32 145.67,44.32 144.02,42.67 D4.A
BATBOTH
  Top 0.61: R10.1 158.24,42.29 158.24,21.08 X1.4
BIS  (via drill 0.61)
  Top 0.254: v41.15,44.7 v48.64,52.2 | v117.98,54.99 118.24,55.25 118.24,56.77 119.25,57.79 U$5.3
  Bottom 0.254: v41.15,44.7 9.4,44.7 7.75,43.05 SV1.14 | v48.64,52.2 48.77,52.32 113.28,52.32 115.95,54.99 v117.98,54.99
GAH
  Top 0.61: RGAH1.1 2.71,75.27 3.05,74.93 10.92,74.93 15.24,70.61 16.89,70.61 | DRV1.12 16.82,64.26 16.89,64.39 16.89,70.61 | RGAH2.1 18.8,81.24 18.8,70.61 16.89,70.61
GAH1  (via drill 0.61)
  Top 0.406: 91.44,68.45 75.31,68.45 73.91,69.85 73.91,80.64 RGCH2.1 | 91.44,68.45 91.44,82.17 RGCH1.1 | v110.11,63.75 109.98,65.79 DRV3.12 | v103.89,67.56 91.57,67.56 91.57,68.33 91.44,68.45
  Bottom 0.406: v103.89,67.56 107.44,67.56 110.11,64.9 v110.11,63.75
GAL
  Top 0.61: RGAL1.1 41.74,80.86 40.39,79.5 40.39,73.53 34.29,67.44 | 34.29,67.44 25.65,67.44 25.65,60.71 21.84,60.71 20.7,59.56 20.7,58.29 DRV1.6 | RGAL2.1 59.44,81.79 59.44,76.41 59.4,70.06 56.77,67.44 34.29,67.44
GAL1
  Top 0.61: RGCL2.1 112.9,81.66 112.9,73.41 116.33,69.98 116.33,67.44 | 116.33,67.44 116.33,62.48 115.7,61.85 114.68,61.85 113.79,60.96 DRV3.6 | RGCL1.1 130.56,81.03 130.56,72.14 129.03,70.61 123.83,70.61 120.65,67.44 116.33,67.44
GBH
  Top 0.406: 20.57,20.07 15.24,14.22 RGBH1.1 | 20.57,20.07 27.3,20.07 27.3,19.43 31.37,14.86 RGBH2.1 | DRV2.12 16.76,41.02 16.51,40.77 16.51,40.64 14.73,38.86 13.46,38.86 13.46,27.18 20.57,20.07
GBH1  (via drill 0.61)
  Top 0.406: 101.35,25.15 92.96,25.15 90.42,22.61 90.42,20.32 87.88,17.78 87.88,17.14 85.85,14.61 RGDH2.1 | 101.35,25.15 101.35,16.89 102.87,14.86 RGDH1.1 | v105.54,30.48 105.66,40.13 109.22,40.13 110.74,41.53 111,41.78 DRV4.12 | v105.54,28.32 104.77,28.32 101.6,25.15 101.35,25.15
  Bottom 0.406: v105.54,28.32 v105.54,30.48
GBL  (via drill 0.81)
  Top 0.61: RGBL1.1 49.4,14.86 48.26,16.04 48.26,26.92 47.88,27.3 | 47.88,27.3 35.94,39.37 22.61,39.37 20.83,37.59 DRV2.6 | RGBL2.1 66.8,13.97 66.8,25.4 65.28,26.92 v54.61,26.92 | 47.88,27.3 v47.5,26.92
  Bottom 0.61: v47.5,26.92 v54.61,26.92
GBL1
  Top 0.61: RGDL2.1 120.65,14.48 119.63,16 119.63,26.92 | 119.63,26.92 119.63,36.83 117.98,38.48 115.19,38.48 114.81,38.1 DRV4.6 | RGDL1.1 138.3,13.72 138.3,15.37 135.64,18.54 135.64,25.4 134.11,26.92 119.63,26.92
GND  (via drill 0.61, 0.81)
  Top 0.254: R15.1 111,30.1 110.74,30.1 110.74,35.05 111,35.56 DRV4.3 | 150.37,63.5 150.24,63.63 150.24,92.71 140.72,92.71 140.21,93.73 UTC.3 | R13.1 17.4,29.08 17.27,29.08 17.27,34.54 17.02,34.8 DRV2.3 | UTB.3 68.71,3.94 71.25,3.94 71.25,24 66.29,28.96 66.29,39.88 | 71.88,65.28 71.75,65.28 71.75,93.34 69.47,93.34 UTA.3 | CD20.2 | UTD.3 139.53,3.56 140.08,3.56 142.88,6.35 142.88,31.24 v143.64,32 | v149.99,38.35 152.53,40.89 D5.A
  Top 0.61: SJ1.2 66.29,39.88 U$3.4 67.31,40.77 65.91,42.16 65.91,50.55 | U$4.4 141.99,62.23 141.22,62.23 U$4.3 v140.97,60.45 | 116.97,49.02 121.16,49.02 121.16,59.44 120.27,60.33 U$5.4 | 116.97,49.02 113.03,49.02 112.78,49.28 112.78,50.55 111.38,51.94 R14.1 110.11,52.96 109.47,52.96 109.47,58.17 109.98,58.67 DRV3.3 109.98,60.71 105.41,65.28 71.88,65.28 71.88,56.13 U$1.4 71.12,54.99 70.48,54.36 69.72,54.36 65.91,50.55 | DRV4.3 111,37.85 114.43,40.89 116.97,40.89 116.97,49.02 | D5.A 153.16,42.67 154.69,44.2 154.69,53.72 151,57.4 | 150.37,60.45 150.37,58.04 151,57.4 | 150.37,60.45 150.37,63.5 R16.1 | 7.49,25.27 5.46,23.24 C21.2 | 7.49,25.27 R6.1 | 7.49,25.27 7.37,25.53 7.37,25.65 5.46,27.56 R8.2 5.46,28.83 5.84,29.21 5.84,41.28 5.65,41.47 | 5.65,41.47 5.84,41.66 5.84,46.23 4.95,47.12 SV1.9 | 5.65,41.47 4.95,40.77 SV1.15 | v17.02,37.85 DRV2.3 | R4.16 2.54,70.99 3.3,70.99 R4.15 3.81,70.99 4.57,70.99 R4.14 5.08,70.99 5.84,70.99 R4.13 6.35,70.99 7.11,70.99 R4.12 7.62,70.99 8.38,70.99 R4.11 8.89,70.99 9.65,70.99 R4.10 10.16,70.99 10.92,70.99 R4.9 11.43,70.36 12.45,69.34 v12.45,57.66 | 16.57,56.83 16,56.26 16,51.69 16.64,51.69 R12.1 16.64,50.67 v14.99,49.02 | 16.57,56.83 16.89,57.15 DRV1.3 | 16.57,56.83 v17.14,56.26 | v32.64,53.34 32.64,54.1 31.75,54.99 U$2.4 | v63.75,53.21 65.91,51.05 65.91,50.55 | 150.37,60.45 C40.2 | v151.89,58.29 151,57.4
  Top 1.27: 89.92,43.69 88.77,43.69 84.96,39.88 U$3.4 | CD19.1 89.92,43.69 | 89.92,43.69 CD20.2
  Bottom 0.254: v149.99,38.35 v143.64,32
  Bottom 0.61: U$5.4 120.52,61.34 131.06,61.34 131.57,60.83 140.46,60.83 v140.97,60.45 149.73,60.45 v151.89,58.29 | v17.02,37.85 16,38.86 6.48,38.86 5.59,39.75 5.21,39.75 SV1.15 | U$2.4 30.73,56.52 29.84,57.4 18.29,57.4 v17.14,56.26 16.76,56.52 13.59,56.52 v12.45,57.66 | v14.99,49.02 6.1,49.02 5.21,48.13 SV1.9 | v32.64,53.34 32.77,53.21 v63.75,53.21
INA  (via drill 0.61)
  Top 0.254: R4.4 5.84,63.63 4.95,62.74 4.95,58.55 SV1.1 | v14.48,60.45 14.48,59.05 DRV1.1
  Bottom 0.254: v14.48,60.45 14.22,60.71 2.79,60.71 2.29,60.2 2.29,58.8 3.43,58.8 3.94,58.29 SV1.1
INB  (via drill 0.61)
  Top 0.254: 3.49,56.71 4.19,56.01 SV1.3 | 3.49,56.71 3.43,56.77 3.43,58.42 4.06,59.05 4.06,63.12 4.57,63.63 R4.3 | v15.24,34.04 15.24,34.29 14.48,34.8 DRV2.1 | v3.56,33.91 3.43,34.04 3.43,56.64 3.49,56.71
  Bottom 0.254: v15.24,34.04 15.11,34.16 7.87,34.16 7.62,33.91 v3.56,33.91
INC  (via drill 0.61)
  Top 0.254: R4.5 7.11,63.63 5.71,62.23 5.71,54.48 4.95,53.72 4.95,53.47 SV1.5 | v73.15,64.14 105.16,64.14 107.19,62.1 107.19,60.58 DRV3.1
  Bottom 0.254: v73.15,64.14 5.46,64.14 1.4,60.07 1.4,53.47 4.19,53.47 SV1.5
IND  (via drill 0.61)
  Top 0.254: v8.76,52.83 8.76,62.74 9.65,63.63 R4.7 | v108.46,38.35 DRV4.1
  Bottom 0.254: v8.76,52.83 7.37,51.44 5.97,51.44 5.21,50.67 SV1.7 3.94,49.91 3.43,49.91 3.43,39.62 4.06,38.99 4.83,38.99 5.21,38.61 5.71,38.61 5.71,37.34 6.6,36.45 23.11,36.45 24.89,34.67 32.38,34.67 41.78,44.07 102.74,44.07 v108.46,38.35
LM61PWR  (via drill 0.61, 0.81)
  Top 0.254: C21.1 3.3,23.24 3.3,24.77 R7.1 2.67,25.91 1.27,25.91 1.27,27.81 2.79,27.81 3.17,28.19 R8.1 3.81,28.83 3.81,29.72 v4.83,30.73 | v137.29,35.43 137.29,25.53 142.37,20.45 142.37,7.11 140.84,5.59 UTD.1 | UTC.1 139.7,90.93 140.21,90.42 149.23,90.42 149.23,59.05 147.83,57.66 146.56,57.66 136.14,47.24 v136.14,44.7 | v40.01,39.75 71.25,70.99 71.25,92.71 69.09,92.71 68.58,92.2 UTA.1 | v71.75,29.84 71.75,2.41 67.44,2.41 67.44,4.57 68.33,4.57 68.83,5.08 UTB.1 | v123.19,31.88 v123.19,42.67
  Bottom 0.254: v4.83,30.73 5.21,30.35 30.61,30.35 v40.01,39.75 40.39,39.5 48.01,31.88 69.47,31.88 v71.75,29.84 71.88,29.59 72.77,28.7 95.5,28.7 99.19,32.38 123.19,32.38 | 123.19,32.38 125.35,32.38 128.4,35.43 v137.29,35.43 | v136.14,44.7 125.22,44.7 v123.19,42.67 | 123.19,32.38 v123.19,31.88
LMIS  (via drill 0.61)
  Top 0.254: v54.86,45.59 v66.42,57.15
  Bottom 0.254: v54.86,45.59 7.75,45.59 SV1.12 | v66.42,57.15 66.55,57.28 72.64,57.28 73.66,56.26 U$1.3
MA1  (via drill 0.81)
  Top 0.61: 105.41,80.52 105.16,79.76 110.49,79.76 110.49,74.42 111.51,73.41 C6.2 | 111.25,65.79 DRV3.11 111.25,68.2 C6.2 | v90.42,70.61 89.66,71.37 89.66,79.25 87.25,81.66 MC2.1 | C6.2
  Top 1.016: 104.65,81.79 104.14,81.79 105.41,80.52
  Top 3.81: QCH1.S 104.65,81.79 MC1.1 | 104.65,92.71 86.87,92.71 134.62,92.71 116.84,92.71 | MC2.1 QCH2.S | QCL1.D MC3.1 | QCL2.D MC4.1
  Top 5.08: 104.65,92.71 QCH1.S | QCH2.S 86.87,92.71 | 134.62,92.71 QCL1.D | 116.84,92.71 QCL2.D
  Bottom 0.61: R5.1 102.87,68.58 90.42,68.58 v90.42,70.61
  pour Top (isolate 0.61, rank 2, no thermals): 83.57,95.38 138.43,95.38 138.43,87.88 83.57,87.88
MA2
  Top 0.61: QAH2.S MA2.1 33.4,82.8 34.93,81.28 34.93,69.98 33.66,68.71 25.15,68.71 24.26,67.82 18.92,67.82 | QAH1.S MA1.1 | QAL1.D MA3.1 | QAL2.D MA4.1 63.5,72.64 55.37,64.52 31.24,64.52 31.24,61.21 26.67,56.64 26.67,54.23 R3.1 | DRV1.11 18.16,64.16 18.16,67.18 18.92,67.82 | C31.2 18.92,67.82
  Top 3.81: 63.5,92.71 45.72,92.71 33.53,92.71 15.75,92.71
  Top 5.08: QAH2.S 33.53,92.71 | 45.72,92.71 QAL1.D | 63.5,92.71 QAL2.D | 15.75,92.71 QAH1.S
  pour Top (isolate 0.61, rank 2, no thermals): 14.22,95.88 69.09,95.88 69.09,88.14 14.22,88.14
MB1
  Top 0.61: DRV4.11 112.27,42.67 | MD2.1 75.69,14.22 82.04,21.08 82.04,25.65 91.69,25.65 95.25,29.21 101.85,29.21 C8.2 104.14,29.46 106.17,29.46 106.68,29.97 106.68,39.37 109.85,39.37 112.27,41.78 DRV4.11 | 116.84,9.91 QDL2.D | C11.2 112.27,45.47 DRV4.11
  Top 3.81: QDH1.S MD1.1 | QDH2.S MD2.1 | QDL1.D MD3.1 | 75.69,4.57 93.34,4.57 | 93.34,4.57 93.47,4.57 | 93.34,4.57 116.84,4.57 134.62,4.57
  Top 5.08: 75.69,4.57 QDH2.S | 93.47,4.57 QDH1.S | 116.84,4.57 116.84,9.91 | 134.62,4.57 QDL1.D
  Bottom 0.813: MD1.1 93.98,14.73
  Bottom 3.81: MD2.1 75.69,10.16 | MD1.1 93.47,10.16 | 116.84,9.91 QDL2.D MD4.1 | MD3.1 134.62,10.16
  pour Top (isolate 0.61, rank 2, no thermals): 73.66,1.27 137.16,1.27 137.16,7.87 73.66,7.87
MB2  (via drill 0.81)
  Top 0.61: C1.2 27.69,20.83 32,16.38 35.18,16.38 36.2,14.99 36.32,4.57 | v17.91,40.01 17.91,40.89 18.03,41.02 DRV2.11 18.29,44.96 18.54,45.21 C18.2 | v13.59,40.01 12.45,38.86 12.45,32.51 12.19,31.88 12.19,8.38 12.91,7.66
  Top 3.81: 4.57,4.57 22.35,4.57 36.32,4.57 45.72,4.57 63.5,4.57
  Top 5.08: 4.57,4.57 MB1.1 | 22.35,4.57 MB2.1 | 45.72,4.57 MB3.1 | 63.5,4.57 MB4.1
  Bottom 0.61: v13.59,40.01 v17.91,40.01
  Bottom 3.81: MB1.1 QBH1.S | 22.35,9.91 QBH2.S MB2.1 | 45.72,9.91 QBL1.D MB3.1 | 63.5,9.91 QBL2.D MB4.1
  pour Top (isolate 0.61, rank 2, no thermals): 4.06,1.27 66.04,1.27 66.04,8.13 4.06,8.13
N$1
  Top 0.61: R11.2 140.46,33.66 140.46,43.69 D2.C
N$2
  Top 0.61: C1.1 R3.2
N$3
  Top 0.254: R12.2 17.91,53.47 18.03,53.59 18.03,57.15 DRV1.4
N$4
  Top 0.61: C8.1 R5.2
N$5
  Top 0.254: R14.2 111.25,54.74 DRV3.4
N$6
  Top 0.254: R15.2 112.27,32 DRV4.4
N$7
  Top 0.61: R9.1 R10.2
N$8
  Top 0.61: D3.C D4.C 138.05,47.12 138.05,37.85 R9.2
N$9
  Top 0.254: R13.2 18.29,30.61 DRV2.4
N$11
  Top 1.016: RGDL3.2 146.81,83.95 QDL3.G
N$12
  Top 0.61: RGDL3.1 148.08,80.43 148.08,65.02 147.32,64.26 144.78,64.26 U$4.6
N$13
  Top 0.254: R1.2 157.35,66.55 D7.A
N$14
  Top 2.184: DUMPL.1 QDL3.D
  Bottom 2.184: D6.1 DUMPL.1
N$15  (via drill 0.61)
  Top 0.254: C40.1 154.56,61.09 154.56,62.87 R16.2 154.18,64.26 153.16,65.79 R1.1 152.27,65.91 v151.64,65.28 | v140.84,65.28 138.43,62.87 U$4.1
  Bottom 0.254: v140.84,65.28 v151.64,65.28
PWRUP
  Top 0.61: D5.C 152.53,45.59 D2.A 149.48,42.67 146.18,39.37 146.18,17.02 147.7,15.49 X1.3
  Bottom 0.61: U$3.1 48.51,37.34 53.34,32.51 87.76,32.51 C22.+ 90.93,29.34 95.12,29.34 99.19,33.4 125.22,33.4 128.27,36.45 143.26,36.45 149.48,42.67 D2.A
Q1G
  Top 1.016: RGAH1.2 4.57,82.68 QAH1.G
Q1G1
  Top 1.016: RGCH1.2 93.6,82.42 QCH1.G
Q2G
  Top 1.016: RGAH2.2 21.72,82.42 21.72,85.98 QAH2.G
Q2G1
  Top 1.016: RGCH2.2 75.69,82.55 QCH2.G
Q3G
  Top 1.016: RGAL1.2 40.13,82.55 QAL1.G
Q3G1
  Top 1.016: RGCL1.2 129.03,82.55 QCL1.G
Q4G
  Top 1.016: RGAL2.2 57.91,82.3 QAL2.G
Q4G1
  Top 1.016: RGCL2.2 111.25,82.42 QCL2.G
Q5G
  Top 1.016: RGBH1.2 16.89,13.59 16.89,10.03 QBH1.G
Q5G1
  Top 1.016: RGDH1.2 104.65,13.46 QDH1.G
Q6G
  Top 1.016: RGBH2.2 33.53,13.72 QBH2.G 33.53,9.91
Q6G1
  Top 1.016: RGDH2.2 87.38,13.46 87.38,10.03 QDH2.G
Q7G
  Top 1.016: RGBL1.2 51.31,13.84 QBL1.G
Q7G1
  Top 1.016: RGDL1.2 140.21,13.46 QDL1.G
Q8G
  Top 1.016: RGBL2.2 69.09,13.21 QBL2.G
Q8G1
  Top 1.016: RGDL2.2 122.43,13.33 QDL2.G
RMIS  (via drill 0.61)
  Top 0.254: v24,41.53 33.53,51.05 33.53,54.99 U$2.3
  Bottom 0.254: v24,41.53 5.97,41.53 5.21,42.29 SV1.13
TEMPA  (via drill 0.61)
  Top 0.254: v25.53,41.53 39.24,41.53 70.74,73.02 70.74,90.68 70.48,90.93 UTA.2
  Bottom 0.254: v25.53,41.53 20.95,36.96 7.49,36.96 SV1.18
TEMPB  (via drill 0.61)
  Top 0.254: v63.37,29.84 70.74,22.48 70.74,7.11 67.44,7.11 67.44,5.67 UTB.2
  Bottom 0.254: v63.37,29.84 4.45,29.84 2.16,32.13 2.16,37.21 3.94,37.21 SV1.17
TEMPC  (via drill 0.81)
  Top 0.254: UTC.2 141.61,90.93 149.73,90.93 149.73,58.55 148.72,57.53 v148.72,56.9
  Bottom 0.254: SV1.20 7.62,35.56 23.24,35.56 24.77,34.04 32.51,34.04 39.12,40.64 48.01,40.64 55.25,33.4 89.15,33.4 92.46,30.1 94.23,30.1 101.09,36.96 110.62,36.96 110.62,38.74 107.19,42.16 106.68,42.16 106.68,45.34 107.19,45.85 137.03,45.85 137.03,48.13 143,54.1 145.92,54.1 v148.72,56.9
TEMPD  (via drill 0.61)
  Top 0.254: v120.65,27.94 134.11,27.94 141.86,20.19 141.86,7.37 139.95,7.37 138.94,6.35 UTD.2 | v22.73,31.24 v25.02,28.96
  Bottom 0.254: v120.65,27.94 120.02,27.05 56.39,27.05 54.48,28.96 v25.02,28.96 | v22.73,31.24 21.97,32 4.19,32 2.67,33.53 2.67,34.8 3.94,34.8 SV1.19
VB1
  Top 0.61: 13.91,54.8 13.84,54.86 13.84,54.99 13.46,54.99 13.46,61.21 15.37,63.12 15.62,63.12 DRV1.13 15.49,65.15 15.49,66.8 15.49,67.69 C31.1 | 13.91,54.8 13.97,54.74 | 13.91,54.8 13.84,54.74 D8.3
VB2  (via drill 0.61)
  Top 0.61: v11.43,33.27 11.56,33.4 11.56,42.04 14.35,44.83 15.37,44.83 15.75,45.21 C18.1 15.75,44.32 | 15.75,44.32 DRV2.13 | 15.75,44.32 15.75,44.83 | D9.3 15.37,31.37 14.48,32.26 v14.48,32.89
  Bottom 0.61: v14.48,32.89 13.59,33.27 v11.43,33.27
VB3  (via drill 0.61)
  Top 0.61: v106.3,61.47 106.3,58.55 106.81,58.04 106.81,56.01 106.93,55.88 107.44,55.88 D10.3 | v108.71,63.88 108.71,65.79 | 108.71,65.79 DRV3.13 | C6.1 108.71,65.79
  Bottom 0.61: v106.3,61.47 v108.71,63.88
VB4  (via drill 0.61)
  Top 0.61: v109.35,34.67 108.71,34.04 D11.3 | DRV4.13 C11.1 108.96,44.96 v107.57,44.96
  Bottom 0.61: v109.35,34.67 112.01,37.34 112.01,44.96 v107.57,44.96
VBATSENSE
  Top 0.254: R6.2 9.14,26.04 9.14,26.29 8.64,26.8 8.64,27.56 R2.1 8.26,28.83 8.26,38.74 7.49,39.5 SV1.16